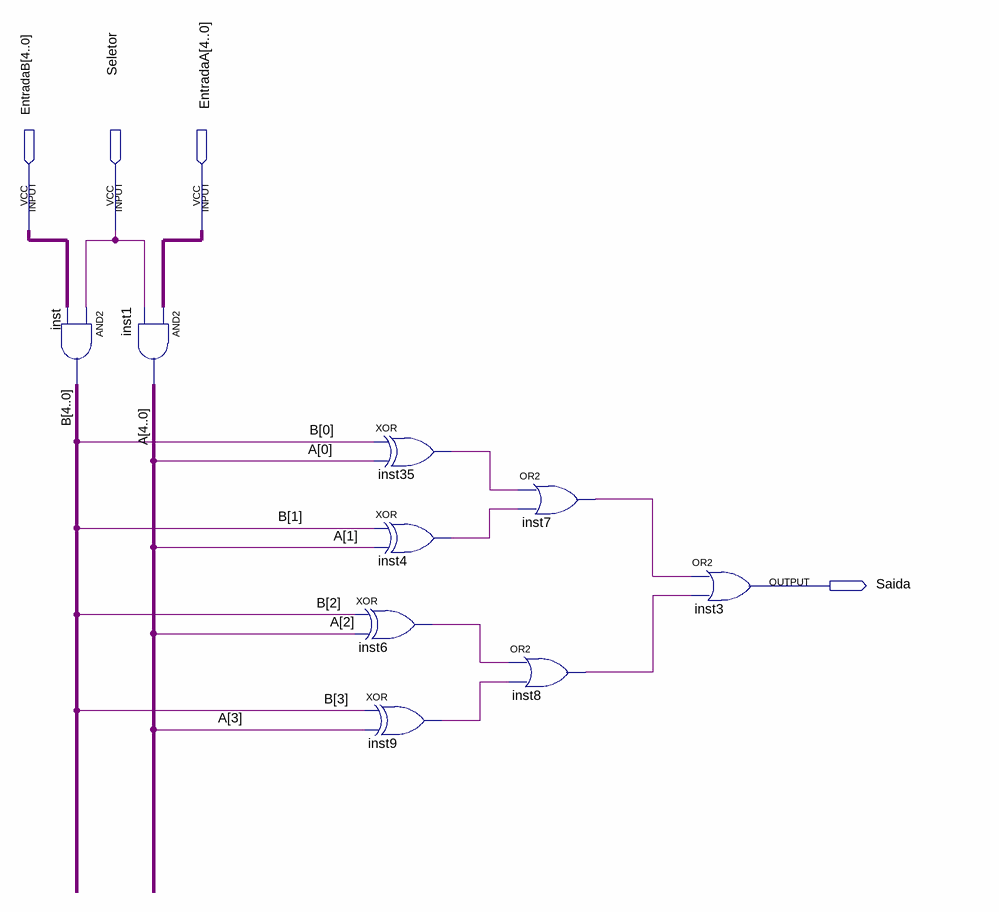
[diagram p0: schematic sheet]
// Quartus schematic ComparadorIgualdade.bdf as structural Verilog: 9 symbols, 4 pins
module ComparadorIgualdade (
  input  [4:0] EntradaB,
  input  Seletor,
  input  [4:0] EntradaA,
  output Saida
);

  wire inst4_out, inst6_out, inst7_out, inst8_out, inst9_out, inst35_out;
  wire [4:0] A, B;

  assign B = {5{Seletor}} & EntradaB;  // AND2 inst, 5 bits wide
  assign A = EntradaA & {5{Seletor}};  // AND2 inst1, 5 bits wide
  xor inst35 (inst35_out, B[0], A[0]);
  xor inst4 (inst4_out, B[1], A[1]);
  xor inst6 (inst6_out, B[2], A[2]);
  xor inst9 (inst9_out, B[3], A[3]);
  or inst7 (inst7_out, inst35_out, inst4_out);
  or inst8 (inst8_out, inst6_out, inst9_out);
  or inst3 (Saida, inst7_out, inst8_out);
endmodule
